# Altium schematic sheet 01_MAIN.SchDoc: =GlobalProjectName
size 410 x 297 mm; CheckedBy: A_D; Author: A_D; SheetNumber: 1; SheetTotal: 1; PageSetup: Record=PageOptions|CenterHorizontal=True|CenterVertical=True|PrintScale=0.70|XCorrection=1.00|YCorrection=1.00|PrintKind=2|BorderSize=5000000|LeftOffset=9000|BottomOffset=10100|Orientation=2|PaperLength=11176|PaperWidth=8636|Scale=100|PaperSource=259|PrintQuality=-3|MediaType=1|DitherType=10|PrintScaleMode=1|PaperKind=A3|PaperIndex=8
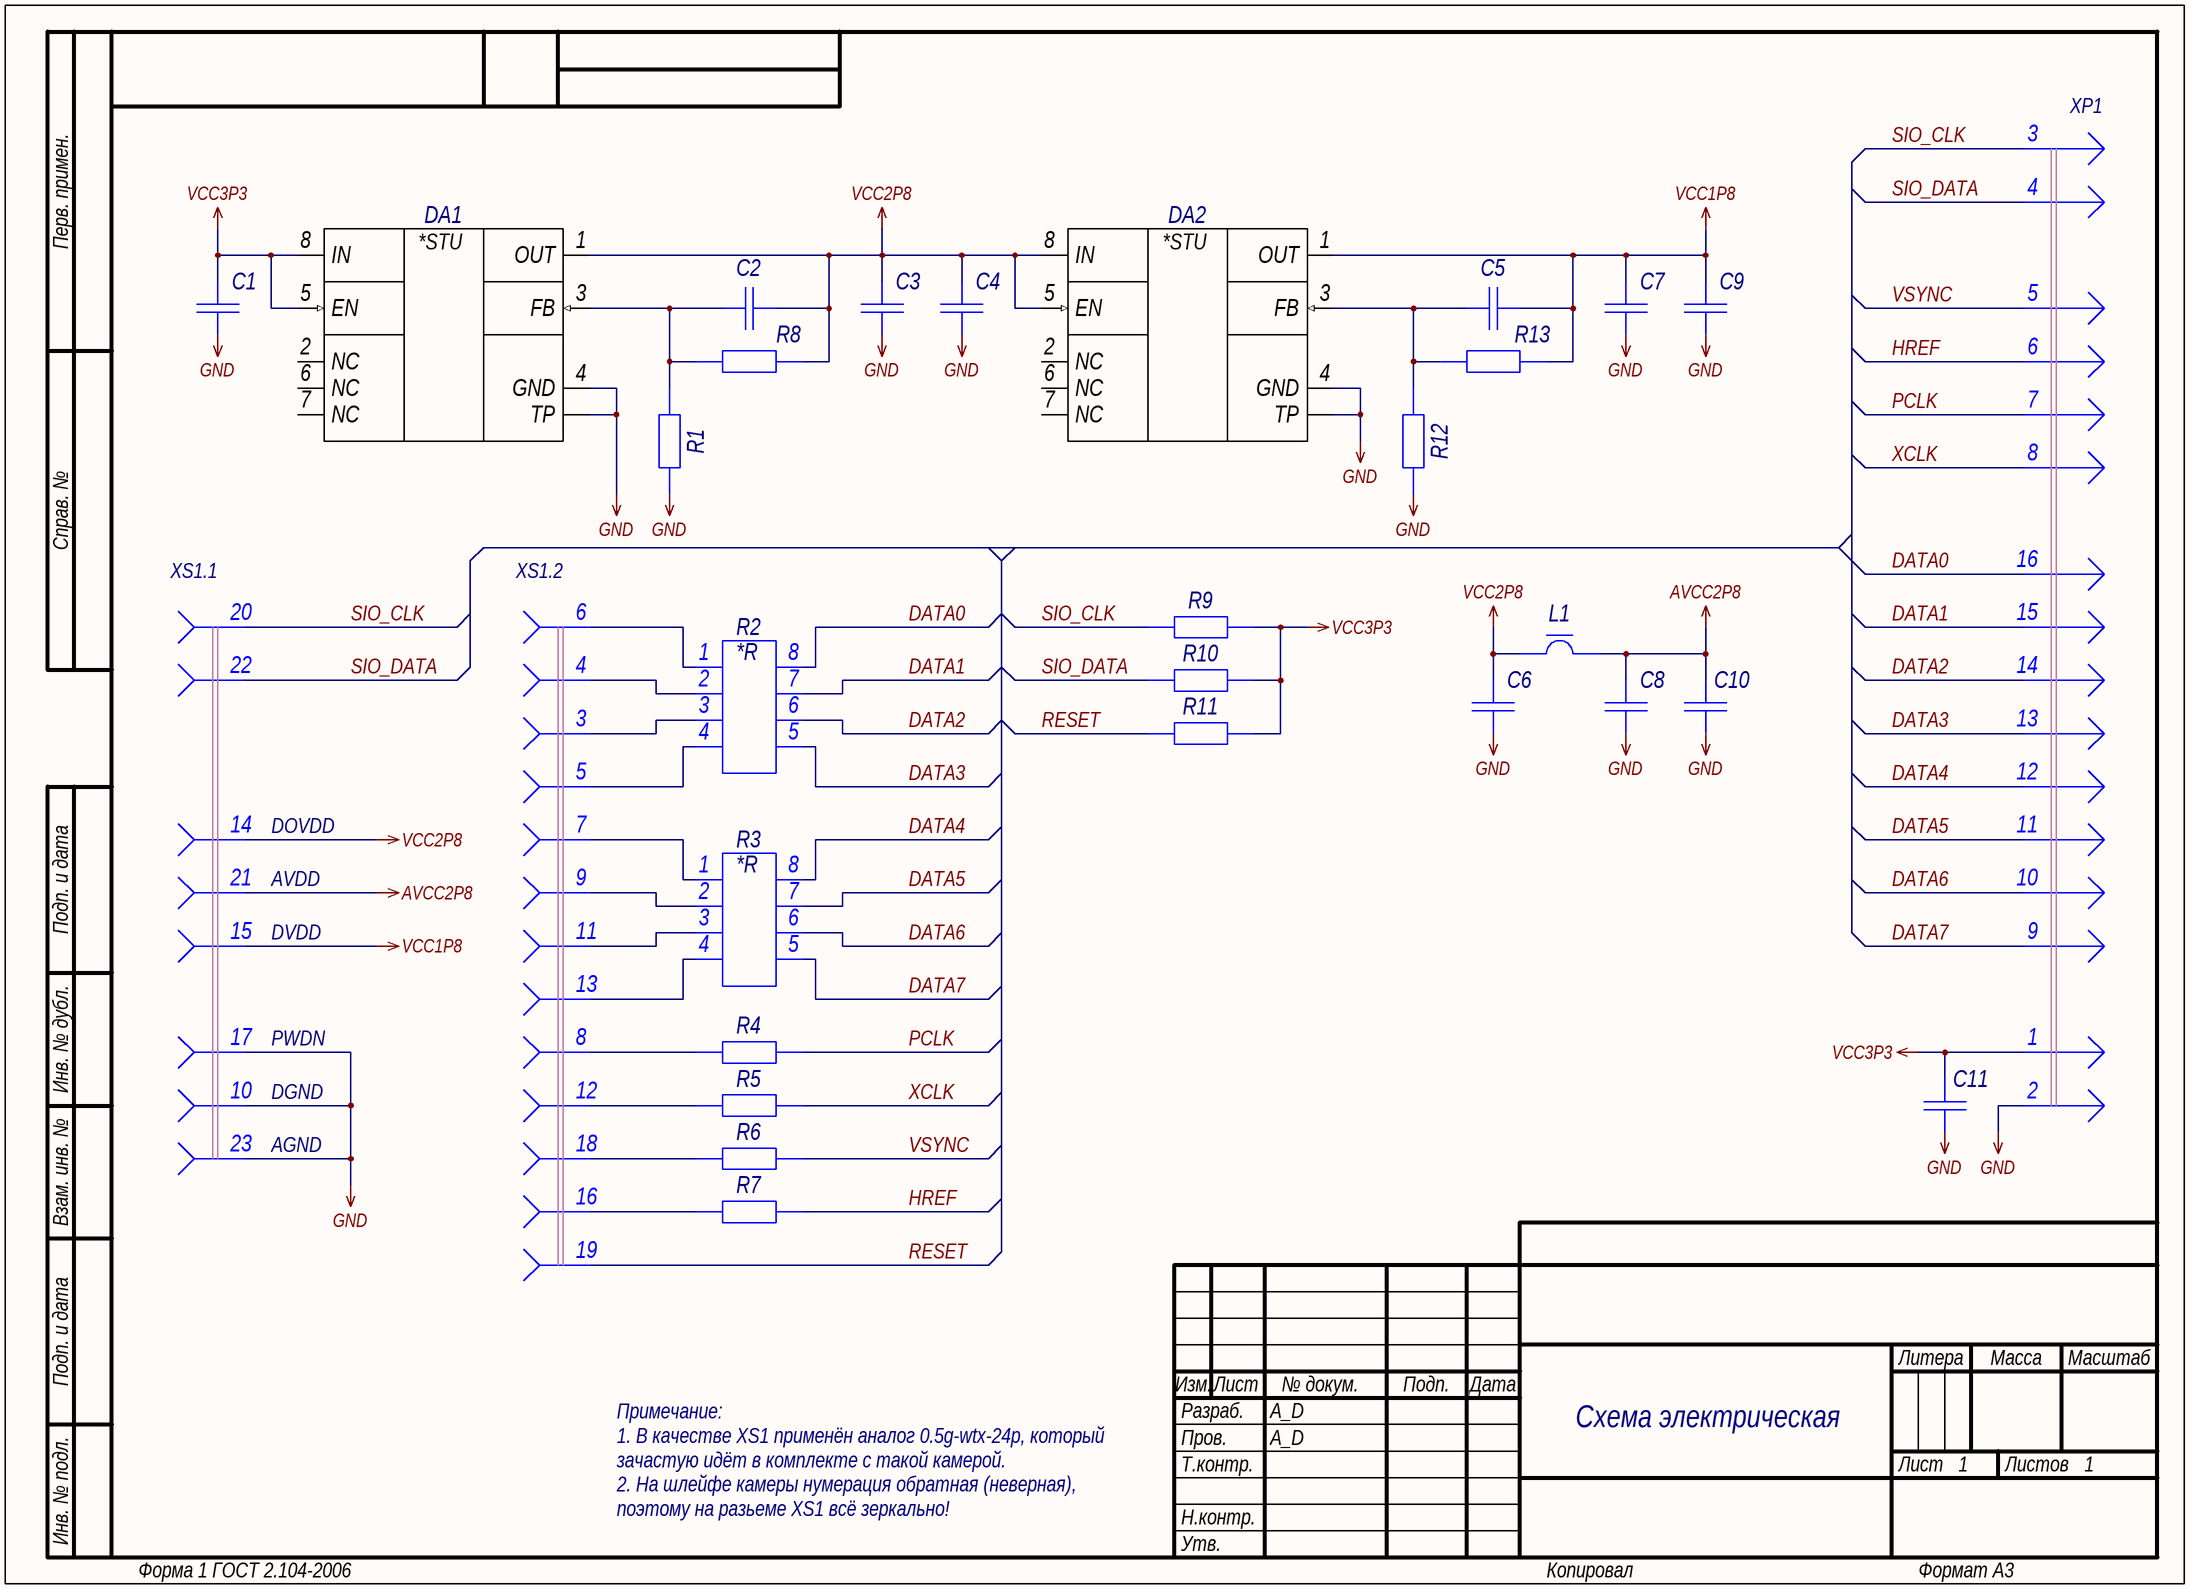
[diagram p0: 01_MAIN.SchDoc]

## Parts
C1  Capacitor  [C0603_L]  (value not drawn)
C2  Capacitor  [C0603_L]  (value not drawn)
C3  Capacitor  [C0603_L]  (value not drawn)
C4  Capacitor  [C0603_L]  (value not drawn)
C5  Capacitor  [C0603_L]  (value not drawn)
C6  Capacitor  [C0603_L]  (value not drawn)
C7  Capacitor  [C0603_L]  (value not drawn)
C8  Capacitor  [C0603_L]  (value not drawn)
C9  Capacitor  [C0603_L]  (value not drawn)
C10  Capacitor  [C0603_L]  (value not drawn)
C11  Capacitor  [C0603_L]  (value not drawn)
DA1  TPS73501DRB  [VSON-8_065P300X300X100_N]  (value not drawn)
DA2  TPS73501DRB  [VSON-8_065P300X300X100_N]  (value not drawn)
L1  FerriteBead  [L0603_L]  (value not drawn)
R1  Resistor  [R0603_L]  (value not drawn)
R2  Resistor-4  [CAT16-x4]  (value not drawn)
R3  Resistor-4  [CAT16-x4]  (value not drawn)
R4  Resistor  [R0603_L]  (value not drawn)
R5  Resistor  [R0603_L]  (value not drawn)
R6  Resistor  [R0603_L]  (value not drawn)
R7  Resistor  [R0603_L]  (value not drawn)
R8  Resistor  [R0603_L]  (value not drawn)
R9  Resistor  [R0603_L]  (value not drawn)
R10  Resistor  [R0603_L]  (value not drawn)
R11  Resistor  [R0603_L]  (value not drawn)
R12  Resistor  [R0603_L]  (value not drawn)
R13  Resistor  [R0603_L]  (value not drawn)
WW1  NoBody  [MH_M2.5]  (value not drawn)  (no BOM)
WW2  NoBody  [MH_M2.5]  (value not drawn)  (no BOM)
XP1  Text  [PLD-16]  (value not drawn)  (parts A,B,C,D,E,F,G,H,I,J,K,L,M,N,O,P of 16)
XS1  OV7670  [FH12-24S-0.5SH]  (value not drawn)  (parts C,D,E,F,G,H,I,J,K,L,M,N,O,P,Q,R,S,T,U,V,W of 24)

## Nets
AVCC2P8: C8.2 C10.2 L1.2 XS1.21
GND: C1.1 C3.1 C4.1 C6.1 C7.1 C8.1 C9.1 C10.1 C11.1 DA1.4(GND) DA1.TP DA2.4(GND) DA2.TP R1.1 R12.1 XP1.2 XS1.10 XS1.17 XS1.23
VCC1P8: C5.2 C7.2 C9.2 DA2.1(OUT) R13.2 XS1.15
VCC2P8: C2.2 C3.2 C4.2 C6.2 DA1.1(OUT) DA2.5(EN) DA2.8(IN) L1.1 R8.2 XS1.14
VCC3P3: C1.2 C11.2 DA1.5(EN) DA1.8(IN) R9.2 R10.2 R11.2 XP1.1
DATA0: R2.8 XP1.16
DATA1: R2.7 XP1.15
DATA2: R2.6 XP1.14
DATA3: R2.5 XP1.13
DATA4: R3.8 XP1.12
DATA5: R3.7 XP1.11
DATA6: R3.6 XP1.10
DATA7: R3.5 XP1.9
HREF: R7.2 XP1.6
PCLK: R4.2 XP1.7
RESET: R11.1 XS1.19
SIO_CLK: R9.1 XP1.3 XS1.20
SIO_DATA: R10.1 XP1.4 XS1.22
VSYNC: R6.2 XP1.5
XCLK: R5.2 XP1.8
NetC2_1: C2.1 DA1.3(FB) R1.2 R8.1
NetC5_1: C5.1 DA2.3(FB) R12.2 R13.1
NetR2_1: R2.1 XS1.6
NetR2_2: R2.2 XS1.4
NetR2_3: R2.3 XS1.3
NetR2_4: R2.4 XS1.5
NetR3_1: R3.1 XS1.7
NetR3_2: R3.2 XS1.9
NetR3_3: R3.3 XS1.11
NetR3_4: R3.4 XS1.13
NetR4_1: R4.1 XS1.8
NetR5_1: R5.1 XS1.12
NetR6_1: R6.1 XS1.18
NetR7_1: R7.1 XS1.16

Not connected (* = marked no-connect by the designer): DA1 2(NC) 6(NC) 7(NC); DA2 2(NC) 6(NC) 7(NC)

## Notes on the sheet
- (near XP1) XP1
- (near XS1) XS1.1
- (near XS1) XS1.2
- (near XS1) DOVDD
- (near XS1) AVDD
- (near XS1) DVDD
- (near XS1) PWDN
- (near XS1) DGND
- (near XS1) AGND
- Схема электрическая
  принципиальная
- Примечание:
  1. В качестве XS1 применён аналог 0.5g-wtx-24p, который зачастую идёт в комплекте с такой камерой.
  2. На шлейфе камеры нумерация обратная (неверная), поэтому на разьеме XS1 всё зеркально!
- Перв. примен.
- Справ. №
- Подп. и дата
- Инв. № дубл.
- Взам. инв. №
- Разраб.
- Изм.
- Лист
- № докум.
- Подп.
- Дата
- Литера
- Масса
- Масштаб
- Пров.
- Т.контр.
- Листов
- Инв. № подл.
- Н.контр.
- Утв.
- Форма 1 ГОСТ 2.104-2006
- Копировал
- Формат А3
- (in symbol TC164-JR-0751RL) *R
- (in symbol TPS73501DRBR) *STU

## Library data of the parts
C1 = GCM188R71E105KA64D: Manufacturer: Murata; Type: Конденсатор; ID: 134; Value: 1uF; Voltage: 25V; Tolerance: ±10%; Dielectric Type: X7R; Application Category: 1; Working Temperature Min: -55°С; Working Temperature Max: +85°С; Published: 18.05.2010; Publisher: Andrew Danich; Part Number: GCM188R71E105KA64D; Footprint: 0603
C2 C5 = GRM1885C1H270JA01D: Manufacturer: Murata; Type: Конденсатор; ID: 213; Value: 27pF; Voltage: 50V; Tolerance: ±5%; Dielectric Type: NP0; Application Category: 1; Working Temperature Min: -55°С; Working Temperature Max: +125°С; Published: 18.05.2010; Publisher: Andrew Danich; Part Number: GRM1885C1H270JA01D; Footprint: 0603
C3 C7 C11 = GRM188R60J106ME47D: Manufacturer: Murata; Type: Конденсатор; ID: 136; Value: 10uF; Voltage: 6.3V; Tolerance: ±20%; Dielectric Type: X5R; Application Category: 1; Working Temperature Min: -55°С; Working Temperature Max: +85°С; Published: 18.05.2010; Publisher: Andrew Danich; Part Number: GRM188R60J106ME47D; Footprint: 0603
C4 C6 C9 C10 = GRM188R72A104KA35D: Manufacturer: Murata; Type: Конденсатор; ID: 232; Value: 0.1uF; Voltage: 100V; Tolerance: ±10%; Dielectric Type: X7R; Application Category: 1; Working Temperature Min: -55°С; Working Temperature Max: +125°С; Published: 18.05.2010; Publisher: Andrew Danich; Part Number: GRM188R72A104KA35D; Footprint: 0603
C8 = GRT188C81E475KE13D: Manufacturer: Murata; Type: Конденсатор; ID: 175; Value: 4.7uF; Voltage: 25V; Tolerance: ±20%; Dielectric Type: X6S; Application Category: 1; Working Temperature Min: -55°С; Working Temperature Max: +105°С; Published: 18.05.2010; Publisher: Andrew Danich; Part Number: GRT188C81E475KE13D; Footprint: 0603
DA1 DA2 = TPS73501DRBR: Manufacturer: Texas Instruments; ID: 27; Input Voltage: +2.2…5.5V; Output Current: 500mA; Output Voltage: +1.2…5.5V; RMS Noise: 13.2uV; Application Category: 1; Working Temperature Min: -40°С; Working Temperature Max: +125°С; Functional Analog: TPS73501DRBT; Published: 25.03.2019; Publisher: Andrew Danich; Type: Микросхема; Part Number: TPS73501DRBR; Value: TPS73501DRBR; ClassName: DirectConnect
L1 = BLM18PG121SN1: Manufacturer: Murata; Type: Дроссель; ID: 4; Rated Current: 2A; Impedance at 100Mhz: 120ohm; Tolerance: ±25%; DC Resistance: 0.05ohm; Inductor Type: EMIFIL; Application Category: 1; Working Temperature Min: -55°С; Working Temperature Max: +125°С; Published: 14.11.2014; Publisher: Andrew Danich; Part Number: BLM18PG121SN1; Value: BLM18PG121SN1; Footprint: 0603
R1 = RC0603FR-0775KL: Manufacturer: Yageo; ID: 395; Value: 75k; Limit Voltage: 50V; Tolerance: ±1%; Temperature Coefficient: 100ppm; Total Power Dissipation: 0.1W; Series Type: Thick-Film; Application Category: 1; Working Temperature Min: -55°С; Working Temperature Max: +155°С; Published: 24.03.2010; Publisher: Andrew Danich; Type: Резистор; Part Number: RC0603FR-0775KL; Footprint: 0603
R2 R3 = TC164-JR-0751RL: Manufacturer: Yageo; ID: 315; Value: 51; Limit Voltage: 50V; Tolerance: ±5%; Temperature Coefficient: 200ppm; Total Power Dissipation: 0,062W; Series Type: Thick-Film; Application Category: 1; Working Temperature Min: -55°С; Working Temperature Max: +125°С; Functional Analog: CAT16-510J4LF; Published: 15.07.2014; Publisher: Andrew Danich; Type: Набор резисторов; Part Number: TC164-JR-0751RL
R4-R7 = RC0603JR-0751RL: Manufacturer: Yageo; ID: 314; Value: 51; Limit Voltage: 50V; Tolerance: ±5%; Temperature Coefficient: 100ppm; Total Power Dissipation: 0.1W; Series Type: Thick-Film; Application Category: 1; Working Temperature Min: -55°С; Working Temperature Max: +155°С; Functional Analog: CR0603-JW-510E; Published: 24.03.2010; Publisher: Andrew Danich; Type: Резистор; Part Number: RC0603JR-0751RL; Footprint: 0603
R8 R13 = RC0603FR-07100KL: Manufacturer: Yageo; ID: 257; Value: 100k; Limit Voltage: 50V; Tolerance: ±1%; Temperature Coefficient: 100ppm; Total Power Dissipation: 0.1W; Series Type: Thick-Film; Application Category: 1; Working Temperature Min: -55°С; Working Temperature Max: +155°С; Published: 24.03.2010; Publisher: Andrew Danich; Type: Резистор; Part Number: RC0603FR-07100KL; Footprint: 0603
R9-R11 = RC0603JR-074K7L: Manufacturer: Yageo; ID: 56; Value: 4.7k; Limit Voltage: 50V; Tolerance: ±5%; Temperature Coefficient: 100ppm; Total Power Dissipation: 0.1W; Series Type: Thick-Film; Application Category: 1; Working Temperature Min: -55°С; Working Temperature Max: +155°С; Published: 24.03.2010; Publisher: Andrew Danich; Type: Резистор; Part Number: RC0603JR-074K7L; Footprint: 0603
R12 = RC0603FR-07200KL: Manufacturer: Yageo; ID: 348; Value: 200k; Limit Voltage: 50V; Tolerance: ±1%; Temperature Coefficient: 100ppm; Total Power Dissipation: 0.1W; Series Type: Thick-Film; Application Category: 1; Working Temperature Min: -55°С; Working Temperature Max: +155°С; Published: 24.03.2010; Publisher: Andrew Danich; Type: Резистор; Part Number: RC0603FR-07200KL; Footprint: 0603
WW1 WW2 = MOUNTINGHOLE: ID: 1; Published: 24.03.2015; Publisher: Andrew Danich; Type: Лепесток; Part Number: MOUNTINGHOLE; Value: MOUNTINGHOLE
XP1 = PLD-16: Value: PLD-16; ID: 103; Limit Voltage: 250V; Limit Current: 3A; Connector Type: Male; Resistance: 15momh; Surface Finish: Gold; Pitch: 2.54mm; Application Category: 1; Published: 28.08.2015; Publisher: НТЦ "Вектор"; Type: Вилка; Part Number: PLD-16; Pins: 16
XS1 = FH12-24S-0.5SH(55): Manufacturer: Hirose Connector; ID: 4; Limit Voltage: 50V; Limit Current: 500mA; Connector Type: Female; Pitch: 0.5mm; Application Category: 1; Published: 09.02.2019; Publisher: Andrew Danich; Type: Розетка; Part Number: FH12-24S-0.5SH(55); Value: FH12-24S-0.5SH(55); Pins: 24; Series: FFC